# Altium schematic sheet eth.schdoc
size A4
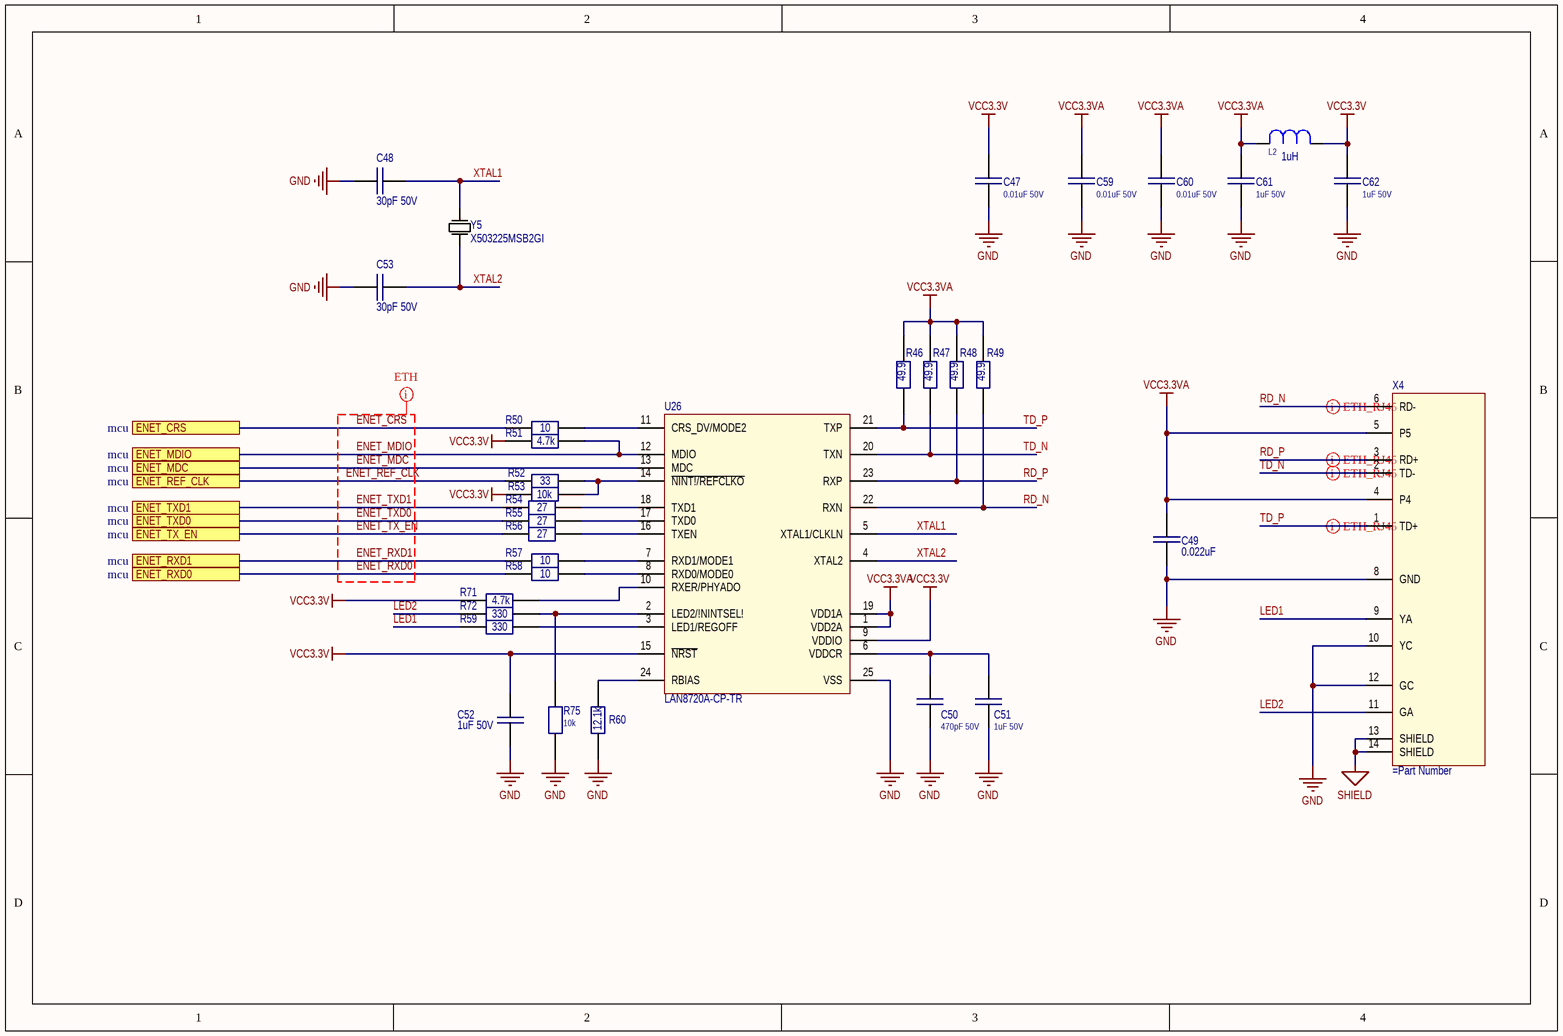
[diagram p0: eth.schdoc]

## Parts
C47  0.01uF 50V  [C_0402]
C48  30pF 50V  [C_0603]
C49  0.022uF  [C_0603]
C50  470pF 50V  [C_0402]
C51  1uF 50V  [C_0603]
C52  1uF 50V  [C_0603]
C53  30pF 50V  [C_0603]
C59  0.01uF 50V  [C_0402]
C60  0.01uF 50V  [C_0402]
C61  1uF 50V  [C_0603]
C62  1uF 50V  [C_0603]
L2  1uH  [L_0603]
R46  49.9  [R_0603]
R47  49.9  [R_0603]
R48  49.9  [R_0603]
R49  49.9  [R_0603]
R50  10  [R_0603]
R51  4.7k  [R_0603]
R52  33  [R_0603]
R53  10k  [R_0603]
R54  27  [R_0603]
R55  27  [R_0603]
R56  27  [R_0603]
R57  10  [R_0603]
R58  10  [R_0603]
R59  330  [R_0603]
R60  12.1k  [R_0603]
R71  4.7k  [R_0603]
R72  330  [R_0603]
R75  10k  [R_0603]
U26  LAN8720A-CP-TR  [QFN50P400X400X100-25N]
X4  (no value)  [RJ45-TH_HR915340A]
Y5  X503225MSB2GI  [X5032]

## Ports
ENET_CRS (see mcu), ENET_MDC (see mcu), ENET_MDIO (see mcu), ENET_REF_CLK (see mcu), ENET_RXD0 (see mcu), ENET_RXD1 (see mcu), ENET_TX_EN (see mcu), ENET_TXD0 (see mcu), ENET_TXD1 (see mcu)

## Nets
GND: C47.2 C48.2 C49.1 C50.2 C51.1 C52.1 C53.2 C59.2 C60.2 C61.1 C62.1 R60.1 R75.1 U26.25(VSS) X4.8(GND) X4.10(YC) X4.12(GC)
SHIELD: X4.13(SHIELD) X4.14(SHIELD)
VCC3.3V: C47.1 C52.2 C62.2 L2.2 R51.1 R53.2 R71.1 U26.9(VDDIO) U26.15(~{NRST})
VCC3.3VA: C49.2 C59.1 C60.1 C61.2 L2.1 R46.2 R47.2 R48.2 R49.2 U26.1(VDD2A) U26.19(VDD1A) X4.4(P4) X4.5(P5)
ENET_CRS: R50.1 ; port ENET_CRS
ENET_MDC: U26.13(MDC) ; port ENET_MDC
ENET_MDIO: R51.2 U26.12(MDIO) ; port ENET_MDIO
ENET_REF_CLK: R52.1 ; port ENET_REF_CLK
ENET_RXD0: R58.1 ; port ENET_RXD0
ENET_RXD1: R57.1 ; port ENET_RXD1
ENET_TX_EN: R56.1 ; port ENET_TX_EN
ENET_TXD0: R55.1 ; port ENET_TXD0
ENET_TXD1: R54.1 ; port ENET_TXD1
LED1: R59.2 X4.9(YA)
LED2: R72.2 X4.11(GA)
RD_N: R49.1 U26.22(RXN) X4.6(RD-)
RD_P: R48.1 U26.23(RXP) X4.3(RD+)
TD_N: R47.1 U26.20(TXN) X4.2(TD-)
TD_P: R46.1 U26.21(TXP) X4.1(TD+)
XTAL1: C48.1 U26.5(XTAL1/CLKLN) Y5.1
XTAL2: C53.1 U26.4(XTAL2) Y5.2
NetC50_1: C50.1 C51.2 U26.6(VDDCR)
NetR50_2: R50.2 U26.11(CRS_DV/MODE2)
NetR52_2: R52.2 R53.1 U26.14(~{NINT!/REFCLKO})
NetR54_2: R54.2 U26.18(TXD1)
NetR55_2: R55.2 U26.17(TXD0)
NetR56_2: R56.2 U26.16(TXEN)
NetR57_2: R57.2 U26.7(RXD1/MODE1)
NetR58_2: R58.2 U26.8(RXD0/MODE0)
NetR59_1: R59.1 U26.3(LED1/REGOFF)
NetR60_2: R60.2 U26.24(RBIAS)
NetR71_2: R71.2 U26.10(RXER/PHYADO)
NetR72_1: R72.1 R75.2 U26.2(LED2/!NINTSEL!)

## Layout directives
differential pair; net class ETH_RJ45; differential pair class RJ45: RD_N, RD_P, TD_N, TD_P
net class ETH: ENET_CRS, ENET_MDC, ENET_MDIO, ENET_REF_CLK, ENET_RXD0, ENET_RXD1, ENET_TX_EN, ENET_TXD0, ENET_TXD1

## Library data of the parts
C47 C59 C60 = C0402: Capacitor; Part: CC0402KRX7R9BB103; Alternative Part: *; JLCPCB Part: C60133
C48 C53 = CAP_SMD: Capacitor; Part: CC0603JRNPO9BN300; Alternative Part: *; Value: 30pF 50V; JLCPCB Part: C113797
C49 = CAP_SMD: Capacitor; Part: CC0603KRX7R9BB223; Alternative Part: *; Value: 0.022uF; JLCPCB Part: C106222
C50 = C0402: Capacitor; Part: CC0402KRX7R9BB471; Alternative Part: *; JLCPCB Part: C106207
C51 C52 = CAP_SMD: Capacitor; Part: CC0603KRX7R9BB105; Alternative Part: *; Value: 1uF 50V; JLCPCB Part: C559769
C61 C62 = C0603: Capacitor; Part: CC0603KRX7R9BB105; Value: 1uF 50V; JLCPCB Part: C559769
L2 = L_0603: Inductor; Part: LQM18FN1R0M00D; Value: 1uH; JLCPCB Part: C113093
R46-R49 = RES_SMD: Resistor; Part: RC0603FR-0749R9L; Alternative Part: *; Value: 49.9; JLCPCB Part: C114625
R50 R57 R58 = RES_SMD: Resistor; Part: RC0603FR-0710RL; Alternative Part: *; Value: 10; JLCPCB Part: C109318
R51 R71 = RES_SMD: Resistor; Part: RC0603FR-074K7L; Alternative Part: *; Value: 4.7k; JLCPCB Part: C99782
R52 = RES_SMD: Resistor; Part: RC0603FR-0733RL; Alternative Part: *; Value: 33; JLCPCB Part: C108661
R53 R75 = RES_SMD: Resistor; Part: RC0603JR-0710KL; Alternative Part: *; Value: 10k; JLCPCB Part: C99198
R54-R56 = RES_SMD: Resistor; Part: RC0402JR-0727RL; Value: 27; JLCPCB Part: C137639
R59 R72 = RES_SMD: Resistor; Part: RC0603FR-07330RL; Alternative Part: *; Value: 330; JLCPCB Part: C105881
R60 = RES_SMD: Resistor; Part: RC0603FR-0712K1L; Alternative Part: *; Value: 12.1k; JLCPCB Part: C123417
U26 = LAN8720: Phy Eth 2/2 Transceiver Full RMII 24-QFN-EP _4x4_; MF: Microchip; Package: QFN-24 Microchip; Value: *; Price: None; MP: LAN8720A-CP; SnapEDA_Link: https://www.snapeda.com/parts/LAN8720A-CP/Microchip/view-part/237160/?ref=snap; Availability: Unavailable; Part: LAN8720A-CP-TR; Alternative Part: *; JLCPCB Part: C45223
X4 = HR915340A: DIP RJ45 Connector;; Package: None; MP: HR915340A; Value: *; Price: None; Availability: Unavailable; Part: HR915340A; Alternative Part: *; JLCPCB Part: C2760325
Y5 = X503212MSB2GI: Crystal Oscillator; Manufacturer_Name: Yangxing Tech; Geometry.Height: 1.35mm; Manufacturer_Part_Number: X503225MSB2GI; Part: X503225MSB2GI; Mouser Price/Stock: *; Alternative Part: *; Arrow Price/Stock: *; Datasheet Link: https://datasheet.lcsc.com/szlcsc/Yangxing-Tech-X503212MSB2GI_C112573.pdf; JLCPCB Part: C112569